# Altium project usb_nanoPAN.PrjPCB
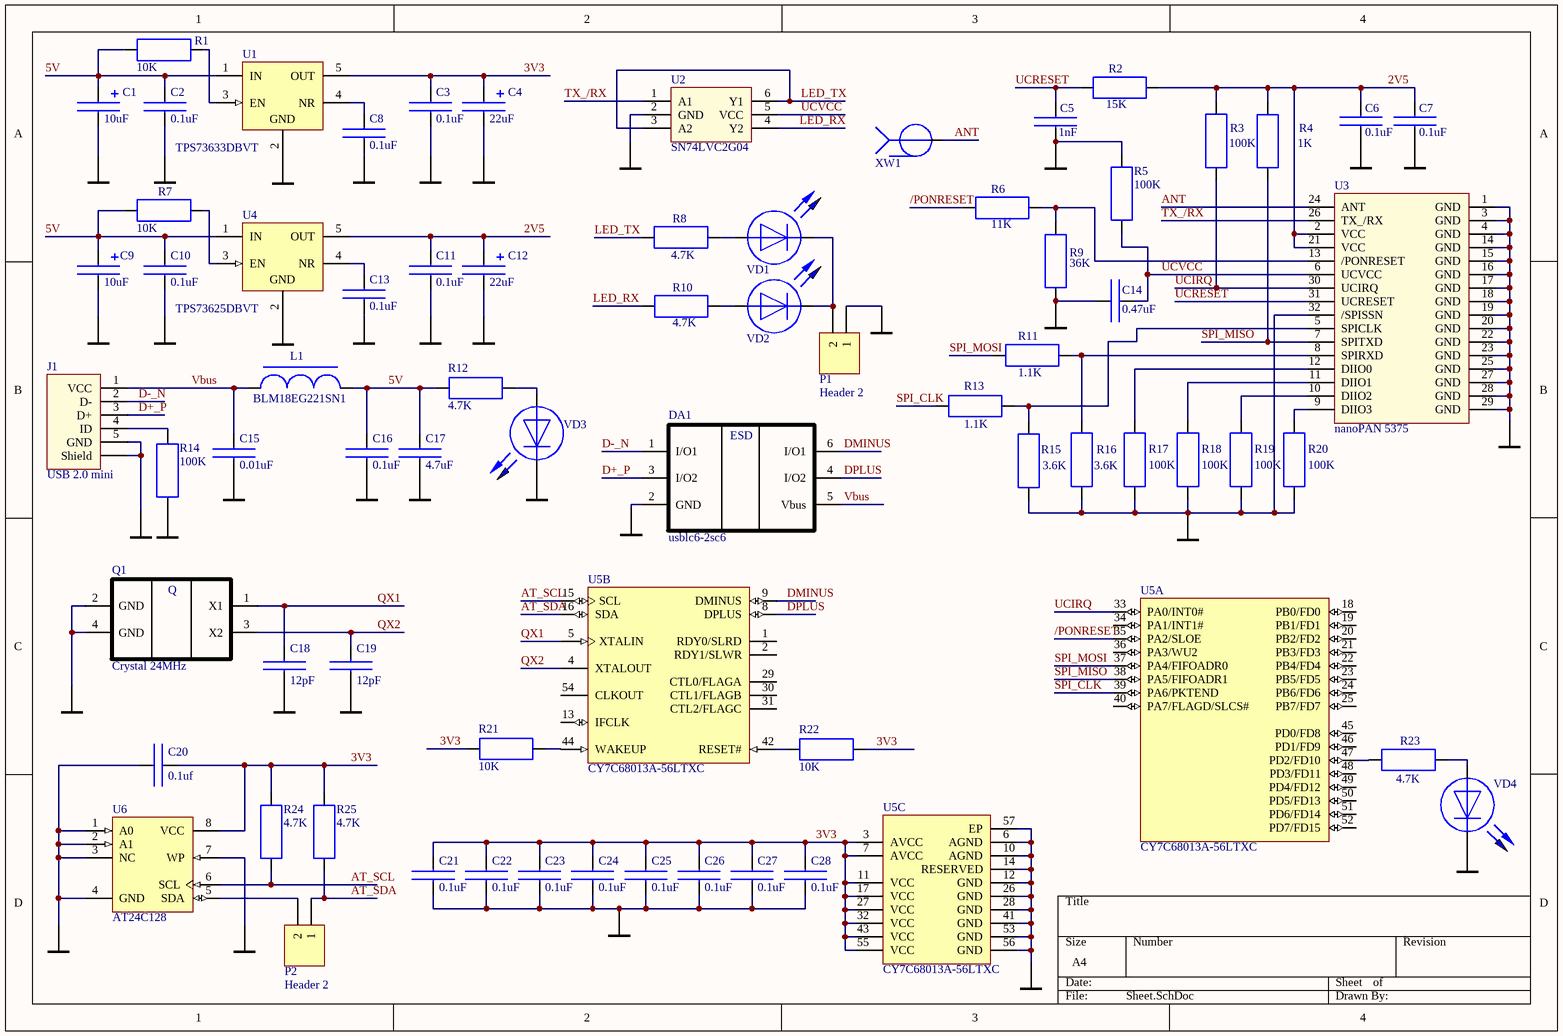
[diagram p0: Sheet.SchDoc]
1 sheet, 70 parts. Net scope: global (net labels, ports and power ports of the same name join across sheets).
Board file: PCB1.PcbDoc

## Sheet Sheet.SchDoc
size A4

### Parts
C1  10uF  [CC3216(1206)x18]
C2  0.1uF  [CAP(0603)]
C3  0.1uF  [CAP(0603)]
C4  22uF  [CC3216(1206)x18]
C5  1nF  [CAP(0603)]
C6  0.1uF  [CAP(0603)]
C7  0.1uF  [CAP(0603)]
C8  0.1uF  [CAP(0603)]
C9  10uF  [CC3216(1206)x18]
C10  0.1uF  [CAP(0603)]
C11  0.1uF  [CAP(0603)]
C12  22uF  [CC3216(1206)x18]
C13  0.1uF  [CAP(0603)]
C14  0.47uF  [CAP(0603)]
C15  0.01uF  [CAP(0603)]
C16  0.1uF  [CAP(0603)]
C17  4.7uF  [CAP(0603)]
C18  12pF  [CAP(0603)]
C19  12pF  [CAP(0603)]
C20  0.1uf  [CAP(0603)]
C21  0.1uF  [CAP(0603)]
C22  0.1uF  [CAP(0603)]
C23  0.1uF  [CAP(0603)]
C24  0.1uF  [CAP(0603)]
C25  0.1uF  [CAP(0603)]
C26  0.1uF  [CAP(0603)]
C27  0.1uF  [CAP(0603)]
C28  0.1uF  [CAP(0603)]
DA1  usblc6-2sc6  [SOT23-6L]
J1  USB 2.0 mini  [65100516121]
L1  BLM18EG221SN1  [BLM18EG221SN1]
P1  Header 2  [HDR1X2]
P2  Header 2  [HDR1X2]
Q1  Crystal 24MHz  [SMD3225]
R1  10K  [RES(0603)]
R2  15K  [RES(0603)]
R3  100K  [RES(0603)]
R4  1K  [RES(0603)]
R5  100K  [RES(0603)]
R6  11K  [RES(0603)]
R7  10K  [RES(0603)]
R8  4.7K  [RES(0603)]
R9  36K  [RES(0603)]
R10  4.7K  [RES(0603)]
R11  1.1K  [RES(0603)]
R12  4.7K  [RES(0603)]
R13  1.1K  [RES(0603)]
R14  100K  [RES(0603)]
R15  3.6K  [RES(0603)]
R16  3.6K  [RES(0603)]
R17  100K  [RES(0603)]
R18  100K  [RES(0603)]
R19  100K  [RES(0603)]
R20  100K  [RES(0603)]
R21  10K  [RES(0603)]
R22  10K  [RES(0603)]
R23  4.7K  [RES(0603)]
R24  4.7K  [RES(0603)]
R25  4.7K  [RES(0603)]
U1  TPS73633DBVT  [TI-DBV5_N]
U2  SN74LVC2G04  [SOT23-6L]
U3  nanoPAN 5375  [nanoPAN_fp]
U4  TPS73625DBVT  [TI-DBV5_N]
U5  CY7C68013A-56LTXC  [CYP-LTX56-5200X4500TP_N]  (parts A,B,C of 3)
U6  AT24C128  [8S1_N]
VD1  VD_6  [LED_0603]  (value not drawn)
VD2  VD_6  [LED_0603]  (value not drawn)
VD3  VD_6  [LED_0603]  (value not drawn)
VD4  VD_6  [LED_0603]  (value not drawn)
XW1  XW_1  [SMA-SV]  (value not drawn)

### Nets
GND: C1.2 C2.1 C3.1 C4.2 C5.1 C6.1 C7.1 C8.1 C9.2 C10.1 C11.1 C12.2 C13.1 C14.2 C15.1 C16.1 C17.1 C18.1 C19.1 C20.1 C21.1 C22.1 C23.1 C24.1 C25.1 C26.1 C27.1 C28.1 DA1.2(GND) J1.5(GND) J1.Shell(Shield) P1.1 Q1.2(GND) Q1.4(GND) R5.2 R9.1 R14.1 R15.1 R16.1 R17.1 R18.1 R19.1 R20.1 U1.2(GND) U2.2(GND) U3.1(GND) U3.3(GND) U3.4(GND) U3.14(GND) U3.15(GND) U3.16(GND) U3.17(GND) U3.18(GND) U3.19(GND) U3.20(GND) U3.22(GND) U3.23(GND) U3.25(GND) U3.27(GND) U3.28(GND) U3.29(GND) U3.32(/SPISSN) U4.2(GND) U5.6(AGND) U5.10(AGND) U5.12(GND) U5.14(RESERVED) U5.26(GND) U5.28(GND) U5.41(GND) U5.53(GND) U5.56(GND) U5.57(EP) U6.1(A0) U6.2(A1) U6.3(NC) U6.4(GND) U6.7(WP) VD3.K VD4.K XW1.2
2V5: C6.2 C7.2 C11.2 C12.1 R2.2 R3.2 R4.2 U3.2(VCC) U3.21(VCC) U4.5(OUT)
3V3: C3.2 C4.1 C20.2 C21.2 C22.2 C23.2 C24.2 C25.2 C26.2 C27.2 C28.2 R21.1 R22.2 R24.2 R25.2 U1.5(OUT) U5.3(AVCC) U5.7(AVCC) U5.11(VCC) U5.17(VCC) U5.27(VCC) U5.32(VCC) U5.43(VCC) U5.55(VCC) U6.8(VCC)
5V: C1.1 C2.2 C9.1 C10.2 C16.2 C17.2 L1.2 R1.1 R7.1 R12.2 U1.1(IN) U4.1(IN)
/PONRESET: R6.1 U5.35(PA2/SLOE)
ANT: U3.24(ANT) XW1.1
AT_SCL: R24.1 U5.15(SCL) U6.6(SCL)
AT_SDA: P2.1 R25.1 U5.16(SDA)
D+_P: DA1.3(I/O2) J1.3(D+)
D-_N: DA1.1(I/O1) J1.2(D-)
DMINUS: DA1.6(I/O1) U5.9(DMINUS)
DPLUS: DA1.4(I/O2) U5.8(DPLUS)
LED_RX: R10.1 U2.4(Y2)
LED_TX: R8.1 U2.3(A2) U2.6(Y1)
QX1: C18.2 Q1.1(X1) U5.5(XTALIN)
QX2: C19.2 Q1.3(X2) U5.4(XTALOUT)
SPI_CLK: R13.1 U5.39(PA6/PKTEND)
SPI_MISO: R4.1 U3.7(SPITXD) U5.38(PA5/FIFOADR1)
SPI_MOSI: R11.1 U5.37(PA4/FIFOADR0)
TX_/RX: U2.1(A1) U3.26(TX_/RX)
UCIRQ: R3.1 U3.30(UCIRQ) U5.33(PA0/INT0#)
UCRESET: C5.2 R2.1 U3.31(UCRESET)
UCVCC: C14.1 R5.1 U2.5(VCC) U3.6(UCVCC)
Vbus: C15.2 DA1.5(Vbus) J1.1(VCC) L1.1
NetC8_2: C8.2 U1.4(NR)
NetC13_2: C13.2 U4.4(NR)
NetJ1_4: J1.4(ID) R14.2
NetP1_2: P1.2 VD1.K VD2.K
NetP2_2: P2.2 U6.5(SDA)
NetR1_2: R1.2 U1.3(EN)
NetR6_2: R6.2 R9.2 U3.13(/PONRESET)
NetR7_2: R7.2 U4.3(EN)
NetR8_2: R8.2 VD1.A
NetR10_2: R10.2 VD2.A
NetR11_2: R11.2 R16.2 U3.8(SPIRXD)
NetR12_1: R12.1 VD3.A
NetR13_2: R13.2 R15.2 U3.5(SPICLK)
NetR17_2: R17.2 U3.12(DIIO0)
NetR18_2: R18.2 U3.11(DIIO1)
NetR19_2: R19.2 U3.10(DIIO2)
NetR20_2: R20.2 U3.9(DIIO3)
NetR21_2: R21.2 U5.44(WAKEUP)
NetR22_1: R22.1 U5.42(RESET#)
NetR23_1: R23.1 U5.47(PD2/FD10)
NetR23_2: R23.2 VD4.A

Not connected (* = marked no-connect by the designer): U5 1(RDY0/SLRD) 2(RDY1/SLWR) 13(IFCLK) 18(PB0/FD0) 19(PB1/FD1) 20(PB2/FD2) 21(PB3/FD3) 22(PB4/FD4) 23(PB5/FD5) 24(PB6/FD6) 25(PB7/FD7) 29(CTL0/FLAGA) 30(CTL1/FLAGB) 31(CTL2/FLAGC) 34(PA1/INT1#) 36(PA3/WU2) 40(PA7/FLAGD/SLCS#) 45(PD0/FD8) 46(PD1/FD9) 48(PD3/FD11) 49(PD4/FD12) 50(PD5/FD13) 51(PD6/FD14) 52(PD7/FD15) 54(CLKOUT)

### Notes on the sheet
- (in symbol Crystal 24MHz) Q
- (in symbol usblc6-2sc6) ESD

### Library data of the parts
C1 C4 C9 C12 = Tantalum: Tantalum SMD capacitor
C2 C3 C5-C8 C10 C11 C13-C28 = CAP
J1 = USB 2.0 mini: Mini USB 2.0 Type B SMT Horizontal 5 Contacts WR-COM
L1 = BLM18EG221SN1: SMD Ferrite Bead 2A 220 Ohm(100MHz); Name: Чип-феррит BLM18EG221SN1; Type: Inductor; Vendor1: Murata Manufacturing, Co., Japan; Ta: -55+125; DC Resistance: 0.05 Ohm; Impedance: 220 Ohm (100MHz) / 260 Ohm (1GHz); Vendor1Name: BLM18EG221SN1; Current: 2 A
P1 P2 = Header 2: Header, 2-Pin; LatestRevisionDate: 17-Jul-2002; LatestRevisionNote: Re-released for DXP Platform.; Publisher: Altium Limited
R1-R25 = RES: Chip Resistor
U1 = TPS73633DBVT: Single Output Low Noise LDO, 400 mA, Fixed 3.3 V Output, 1.7 to 5.5 V Input, with Reverse Current Protection, 5-pin SOT-23 (DBV), -40 to 85 degC, Green (RoHS & no Sb/Br); Manufacturer: Texas Instruments; Accuracy(%): 1; Fixed Output Options(V): 3.3; Iout(Max)(A): 0.4; Iq(Typ)(mA): 0.3; Rating: Catalog; SubFamily: Single Channel LDO; Vdo(Typ)(mV): 75; Vin(Max)(V): 5.5; Vin(Min)(V): 1.7; DatasheetVersion: SBVS038T; PackageVersion: 4073253-4/K; PackageReference: DBV5; PackageDescription: 5-Pin Plastic Small Outline, Body 1.60 Г— 2.90 mm, Pitch 0.95 mm; Eco-Plan: Green (RoHS & no Sb/Br); Vout Adj(Max)(V): 3.3; Vout Adj(Min)(V): 3.3; Mounting Technology: Surface Mount; Code_JEDEC: MO-178; PartNumber: TPS73633DBVT
U2 = SN74LVC2G04DBVR
U3 = nanoPAN
U4 = TPS73625DBVT: Single Output Low Noise LDO, 400 mA, Fixed 2.5 V Output, 1.7 to 5.5 V Input, with Reverse Current Protection, 5-pin SOT-23 (DBV), -40 to 85 degC, Green (RoHS & no Sb/Br); Manufacturer: Texas Instruments; Accuracy(%): 1; Fixed Output Options(V): 2.5; Iout(Max)(A): 0.4; Iq(Typ)(mA): 0.3; Rating: Catalog; SubFamily: Single Channel LDO; Vdo(Typ)(mV): 75; Vin(Max)(V): 5.5; Vin(Min)(V): 1.7; DatasheetVersion: SBVS038T; PackageVersion: 4073253-4/K; PackageReference: DBV5; PackageDescription: 5-Pin Plastic Small Outline, Body 1.60 Г— 2.90 mm, Pitch 0.95 mm; Eco-Plan: Green (RoHS & no Sb/Br); Vout Adj(Max)(V): 2.5; Vout Adj(Min)(V): 2.5; Mounting Technology: Surface Mount; Code_JEDEC: MO-178; PartNumber: TPS73625DBVT
U5 = CY7C68013A-56LTXC: EZ-USB(R) FX2LP(TM) USB Microcontroller High-Speed USB Peripheral Controller, 16 KB, 24 I/Os, 3 to 3.6 V, 0 to 70 degC, 56-Pin QFN (LTX56), Tray